# EAGLE design lvc-strobe-generator (EAGLE 9.4.1)
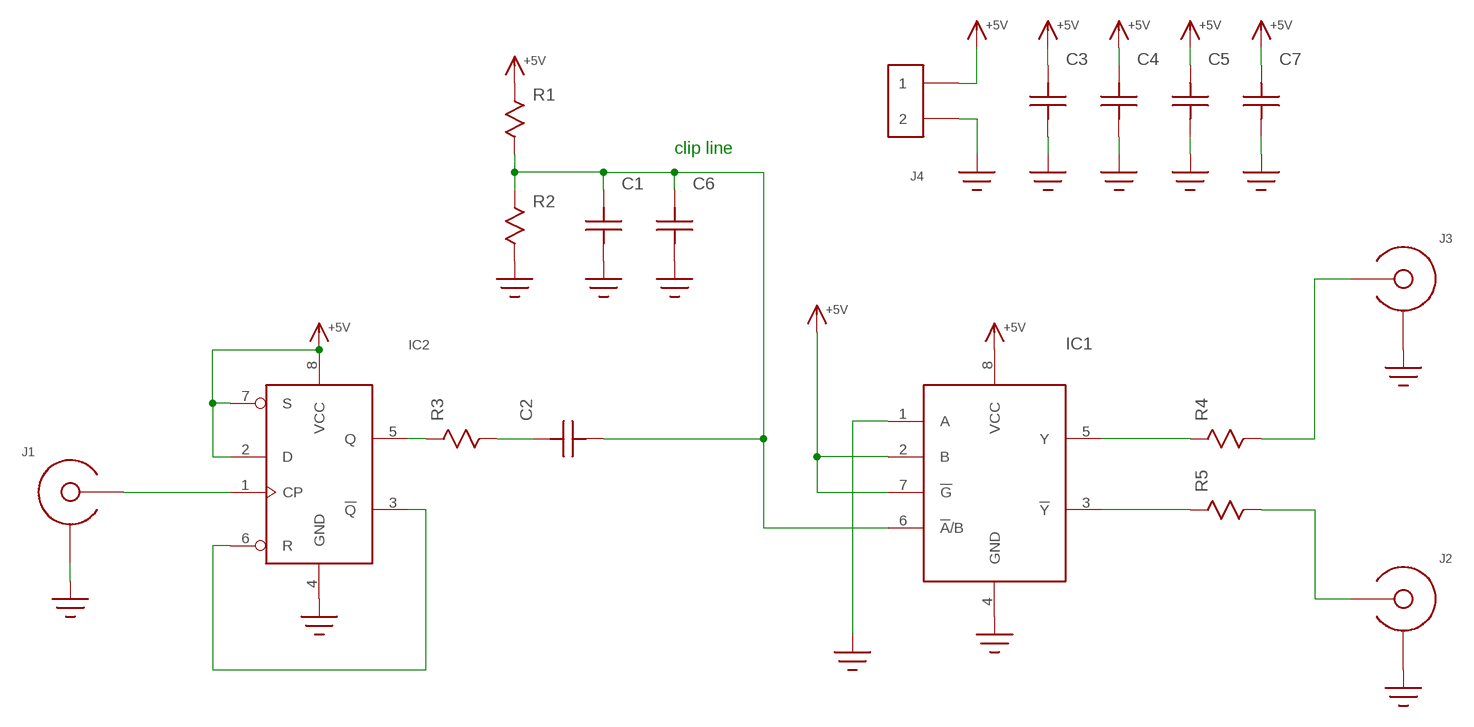
[diagram p0: schematic, sheet 1]

## Parts
C1  C  [C0402]
C2  C  [C0402]
C3  C1206  [1206]
C4  C0603  [C0603]
C5  C0603  [C0603]
C6  C  [C0402]
C7  C0603  [C0603]
IC1  74LVC2G157  [SSOP8]
IC2  74LVC2G74  [SSOP8]
J1  SMA-EDGE-LAUNCH4L-4020-TAPER-FIXED  [SMA_EDGE_LAUNCH_4L_4020_TAPER_FIXED]
J2  SMA-EDGE-LAUNCH4L-4020-TAPER-FIXED  [SMA_EDGE_LAUNCH_4L_4020_TAPER_FIXED]
J3  SMA-EDGE-LAUNCH4L-4020-TAPER-FIXED  [SMA_EDGE_LAUNCH_4L_4020_TAPER_FIXED]
J4  HEADER_2PIN  [HEADER_2PIN]
R1  R0603  [R0603]
R2  R0603  [R0603]
R3  R0402  [0402]
R4  R0603  [R0603]
R5  R0603  [R0603]

## Nets
+5V: C3.P$2 C4.P$2 C5.P$2 C7.P$2 IC1.2(B) IC1.7(!G!) IC1.8(VCC) IC2.2(D) IC2.7(S) IC2.8(VCC) J4.1 R1.P$1
GND: C1.1 C3.P$1 C4.P$1 C5.P$1 C6.1 C7.P$1 IC1.1(A) IC1.4(GND) IC2.4(GND) J1.BOTTOM_GND(SHIELD) J1.GND@1(SHIELD) J1.GND@2(SHIELD) J1.GND@3(SHIELD) J1.GND@4(SHIELD) J1.GND@5(SHIELD) J1.GND@6(SHIELD) J1.GND@7(SHIELD) J1.GND@8(SHIELD) J1.GND@14(SHIELD) J1.GND@15(SHIELD) J1.GND@16(SHIELD) J1.GND@17(SHIELD) J1.GND_PAD1(SHIELD) J1.GND_PAD2(SHIELD) J1.P$1(SHIELD) J1.P$2(SHIELD) J2.BOTTOM_GND(SHIELD) J2.GND@1(SHIELD) J2.GND@2(SHIELD) J2.GND@3(SHIELD) J2.GND@4(SHIELD) J2.GND@5(SHIELD) J2.GND@6(SHIELD) J2.GND@7(SHIELD) J2.GND@8(SHIELD) J2.GND@14(SHIELD) J2.GND@15(SHIELD) J2.GND@16(SHIELD) J2.GND@17(SHIELD) J2.GND_PAD1(SHIELD) J2.GND_PAD2(SHIELD) J2.P$1(SHIELD) J2.P$2(SHIELD) J3.BOTTOM_GND(SHIELD) J3.GND@1(SHIELD) J3.GND@2(SHIELD) J3.GND@3(SHIELD) J3.GND@4(SHIELD) J3.GND@5(SHIELD) J3.GND@6(SHIELD) J3.GND@7(SHIELD) J3.GND@8(SHIELD) J3.GND@14(SHIELD) J3.GND@15(SHIELD) J3.GND@16(SHIELD) J3.GND@17(SHIELD) J3.GND_PAD1(SHIELD) J3.GND_PAD2(SHIELD) J3.P$1(SHIELD) J3.P$2(SHIELD) J4.2 R2.P$2
N$1 [12-18]: IC2.5(Q) R3.1
N$2 [12-18]: C1.2 C2.1 C6.2 IC1.6(!A!/B) R1.P$2 R2.P$1
N$3: IC2.3(!Q!) IC2.6(R)
N$4 [12-18]: C2.2 R3.2
N$5: IC1.5(Y) R4.P$1
N$6: IC1.3(!Y!) R5.P$1
N$7: IC2.1(CP) J1.CENTER@1(CENTER) J1.P$3(CENTER)
N$8 [29-6]: J3.CENTER@1(CENTER) J3.P$3(CENTER) R4.P$2
N$9 [29-6]: J2.CENTER@1(CENTER) J2.P$3(CENTER) R5.P$2

## Notes on the sheet
- clip line

## Library data of the parts
C1-C7 = yapo:C
IC1 = yapo:74LVC2G157
IC2 = yapo:74LVC2G74
J1-J3 = sma_footprint_2l:SMA-EDGE-LAUNCH
J4 = yapo:HEADER_2PIN
R1-R5 = yapo:R

## Net classes
1 12-18: width 0.305 mm, clearance 0.457 mm
2 29-6: width 0.737 mm, clearance 0.152 mm

## Board
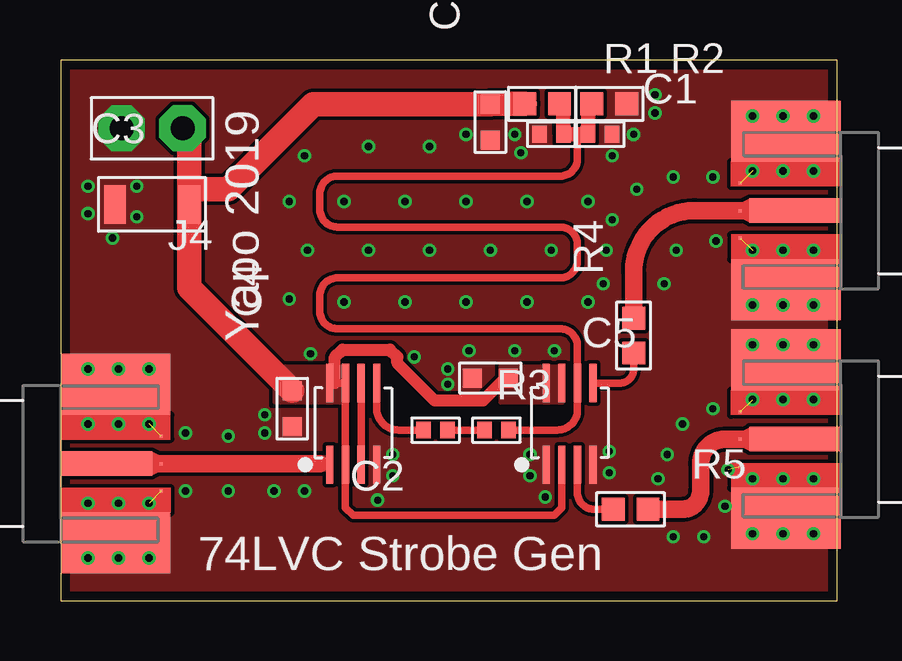
[diagram p1: board, top side]
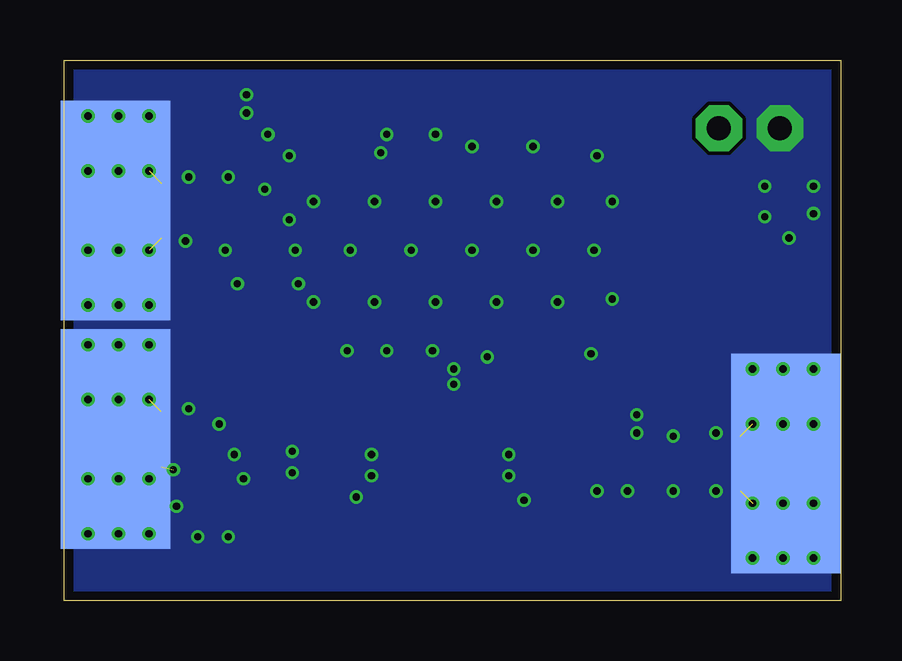
[diagram p2: board, bottom side, seen from below]

Size 32.37 x 22.53 mm. Coordinates in mm from the lower left corner, seen from the top.
Outline: 0,0 32.37,0 32.37,22.53 0,22.53 0,0
Copper layers (1*16): Top 0.035559375mm / dielectric 1.6mm / Bottom 0.035559375mm
Design rules "oshpark-2layer *": minimum track width 6mil, minimum drill 10mil, track to track 6mil, track to pad 6mil, pad to pad 6mil, via to via 6mil, smd to smd 6mil, copper to edge 15mil, drill to drill 6mil, minimum pad ring 5mil, minimum via ring 5mil, stop-mask expansion 2.5mil, vias tented up to drill 20mil, thermal gap 10mil

### Footprints (pad centres in the part's own frame; a part is rotated, then mirrored left to right if it is on the bottom)
C0402 = smd 0.6 x 0.7: 1 -0.5,0; 2 0.5,0
1206 = smd 0.9 x 1.6: P$1 -1.55,0; P$2 1.55,0
C0603 = smd 0.8 x 0.8: P$1 -0.75,0; P$2 0.75,0
SSOP8 = smd 0.3 x 1.6: 1 -0.975,-1.7; 2 -0.325,-1.7; 3 0.325,-1.7; 4 0.975,-1.7; 5 0.975,1.7; 6 0.325,1.7; 7 -0.325,1.7; 8 -0.975,1.7
SMA_EDGE_LAUNCH_4L_4020_TAPER_FIXED = smd 4.572 x 9.144 bottom: BOTTOM_GND 2.286,0 | smd 3.81 x 1.016: CENTER@1 1.905,0 | drill 0.3: GND@1 1.143,3.937; GND@2 3.683,3.937; GND@3 1.143,1.651; GND@4 3.683,1.651; GND@5 1.143,-1.651; GND@6 3.683,-1.651; GND@7 1.143,-3.937; GND@8 3.683,-3.937; GND@14 2.413,3.937; GND@15 2.413,-3.937; GND@16 2.413,-1.651; GND@17 2.413,1.651 | smd 4.572 x 2.54: GND_PAD1 2.286,3.302; GND_PAD2 2.286,-3.302 | smd 0.127 x 0.127: P$1 4.191,1.143; P$2 4.191,-1.143; P$3 4.191,0
HEADER_2PIN = drill 1 pad 1.93 octagon: 1 -1.27,0; 2 1.27,0
R0603 = smd 0.95 x 0.95: P$1 -0.725,0; P$2 0.725,0
0402 = smd 0.6 x 0.7: 1 -0.5,0; 2 0.5,0

### Placement (x,y rotation side)
C1  20.45,19.43 0 top
C2  18.16,7.11 180 top
C3  3.81,16.51 0 top
C4  9.65,8 90 top
C5  17.91,9.27 0 top
C6  22.48,19.43 180 top
C7  17.91,19.94 90 top
IC1  21.21,7.37 0 top
IC2  12.19,7.37 0 top
J1  0,5.71 0 top
J2  32.51,6.73 180 top
J3  32.51,16.26 180 top
J4  3.81,19.68 180 top
R1  20.07,20.7 0 top
R2  22.86,20.7 0 top
R3  15.62,7.11 0 top
R4  23.88,11.05 90 top
R5  23.75,3.81 0 top

### Tracks (layer width: path | path; a pad name or v marks a point on that pad's centre or on a via)
+5V
  Top 0.305: IC1.2 20.88,3.87 20.57,3.56 12.19,3.56 11.87,3.88 IC2.2 IC2.7 11.43,9.07 IC2.8
  Top 0.508: C5.P$2 18.53,9.27 17.59,8.33 15.59,8.33 14.03,9.9 14.03,10.16 13.72,10.47 11.74,10.47 11.43,10.16 11.43,9.07
  Top 1.016: J4.1 5.36,19.41 5.36,17.14 | 5.36,17.14 C3.P$2 5.36,13.04 C4.P$2 | R1.P$1 17.92,20.7 C7.P$2 10.53,20.69 6.99,17.14 5.36,17.14
  pour Top (no thermals): 8.89,8.26 11.94,8.26 11.94,9.78 8.89,9.78
  pour Top (no thermals): 20.95,9.78 18.29,9.78 18.29,8.26 20.95,8.26
GND  (via drill 0.3)  (6 unrouted)
  other vias: 11.81,16.64 11.81,12.45 20.45,14.61 17.91,14.61 15.37,14.61 12.83,14.61 14.35,16.64 16.89,16.64 19.43,16.64 14.35,12.45 16.89,12.45 19.43,12.45 21.97,12.45 10.29,14.61 21.97,16.64 9.53,16.64 9.53,12.57 22.73,14.61 10.16,18.54 10.41,10.29 12.83,18.92 15.37,18.92 18.92,19.43 16.89,19.43 23.88,19.43 19.18,18.67 22.99,18.54 24.77,21.08 24.77,20.32 14.73,10.16 17.02,10.41 16.13,9.65 16.13,9.02 18.92,10.41 20.57,10.41 27.3,14.99 27.18,17.65 25.53,17.65 24,17.14 22.99,15.88 25.65,14.61 25.15,13.21 22.61,13.21 27.18,8 25.91,7.37 25.27,6.1 24.89,5.08 27.81,5.46 27.69,3.94 26.8,2.67 25.53,2.67 5.21,6.99 8.51,7.75 8.51,6.99 6.99,6.86 6.99,4.57 5.21,4.57 8.89,4.57 10.16,4.57 19.56,6.1 19.56,5.21 20.19,4.32 13.84,6.1 13.84,5.21 13.21,4.19 22.86,6.22 22.86,5.33 3.17,17.27 2.16,15.11 3.17,16 1.14,17.27 1.14,16.13
  pour Top (rank 2, no thermals): 0,0 33.02,0 33.02,22.23 0,22.23
  pour Bottom (rank 2, no thermals): 0,0 33.02,0 33.02,22.23 0,22.23
N$1
  Top 0.305: R3.1 14.1,7.11 arc-90 13.17,8.04 IC2.5
N$2
  Top 0.305: C2.1 20.7,7.11 arc90 21.53,7.95 IC1.6 21.53,10.61 arc90 20.81,11.33 11.53,11.33 arc-90 10.8,12.05 10.8,12.73 arc-90 11.53,13.45 20.81,13.45 arc90 21.53,14.18 21.53,14.85 arc90 20.81,15.57 11.53,15.57 arc-90 10.8,16.3 10.8,16.97 arc-90 11.53,17.69 20.81,17.69 arc90 21.53,18.41 21.53,19.43 | 20.9,19.38 arc-90 C1.2 arc90 20.9,19.38
  Top 0.508: C6.2 21.59,19.43 21.53,19.43
  Top 0.61: 21.59,19.43 C1.2 20.95,20.55 R1.P$2 | C6.2 21.98,20.55 R2.P$1
N$3
  Top 0.318: IC2.6 IC2.3
N$4
  Top 0.305: R3.2 C2.2
N$5
  Top 0.305: IC1.5 23.29,9.07 arc90 23.88,9.65 R4.P$1
N$6
  Top 0.305: IC1.3 21.53,4.5 arc90 22.23,3.81 R5.P$1
N$7
  Top 0.305: IC2.1 10.84,5.67 10.79,5.71
  Top 0.737: 10.79,5.71 J1.CENTER@1
  pour Top (no thermals): 10.29,6.02 11.18,6.02 11.18,5.41 10.29,5.41
N$8
  Top 0.737: R4.P$2 23.88,13.72 arc-90 26.42,16.26 J3.CENTER@1
N$9
  Top 0.737: J2.CENTER@1 27.69,6.73 arc90 26.67,5.71 26.67,4.57 arc-90 25.91,3.81 R5.P$2

### Text on the board
tPlace: Yapo 2019 | 74LVC Strobe Gen